# Altium schematic sheet Sheet1.SchDoc
size A3; Date: 2016.9.19; CheckedBy: CloudBoy; Author: CloudBoy; CompanyName: CloudStudio; Revision: V2.0; SheetNumber: 1; SheetTotal: 1; CurrentTime: 17:23; CurrentDate: 2016.9.19; DocumentName: CloudF4Block_Main
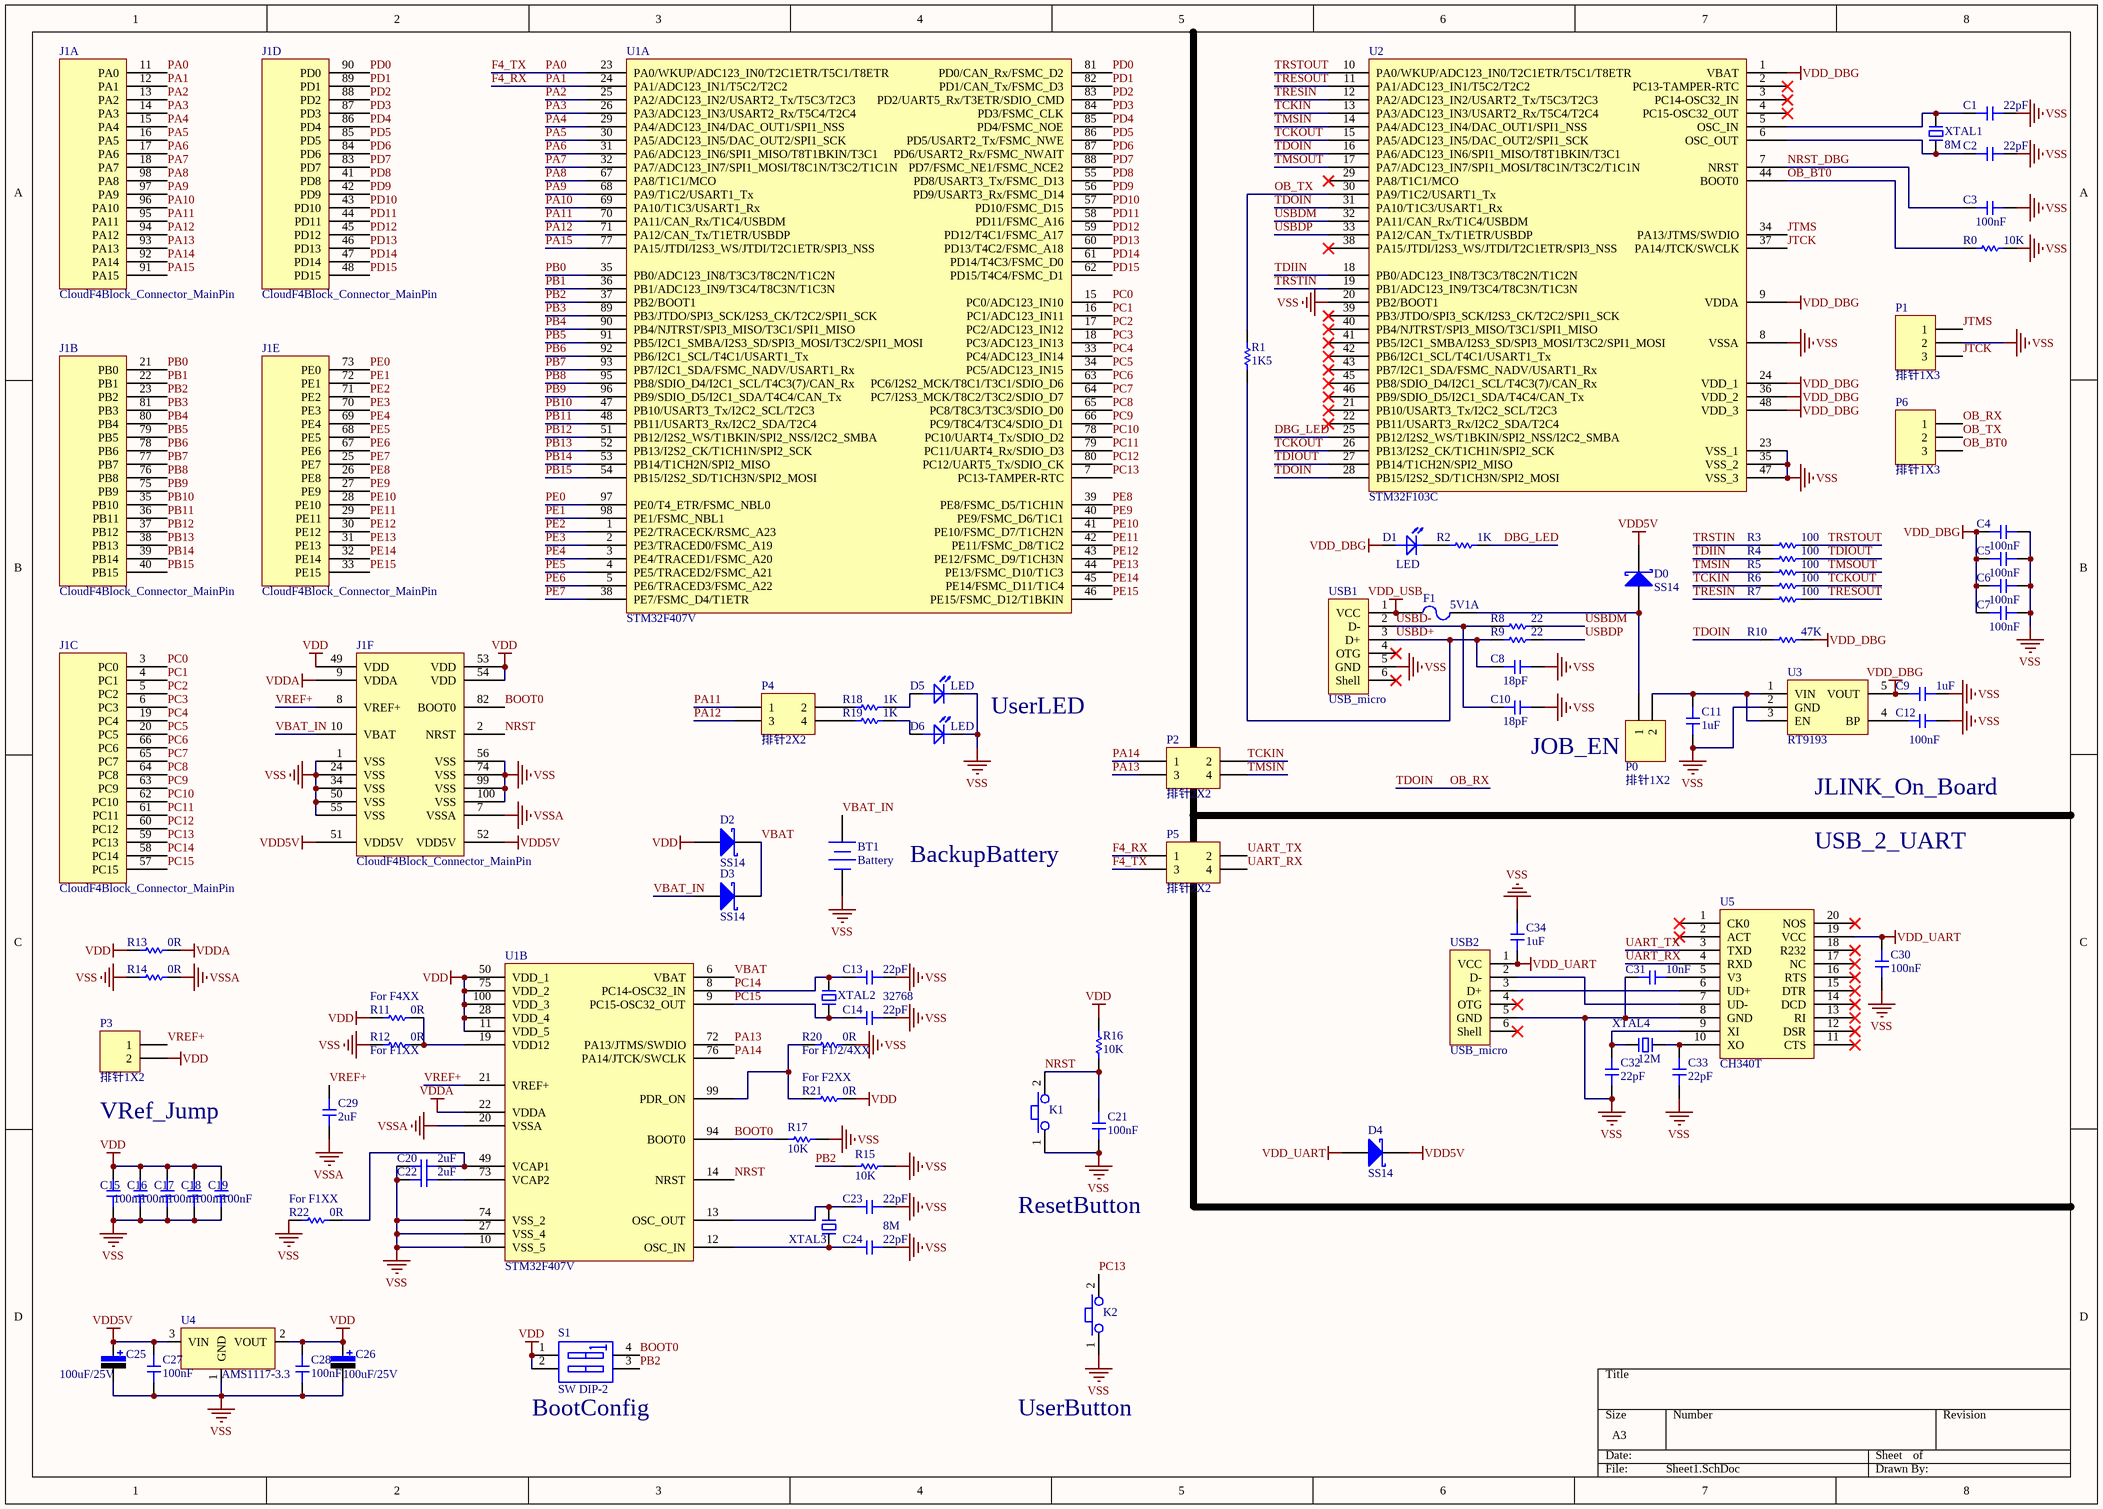
[diagram p0: Sheet1.SchDoc]

## Parts
BT1  Battery  [CR1220]
C1  value 22pF  [C-0603]  (hidden comment: Cap)
C2  value 22pF  [C-0603]  (hidden comment: Cap)
C3  value 100nF  [C-0603]  (hidden comment: Cap)
C4  value 100nF  [C-0603]  (hidden comment: Cap)
C5  value 100nF  [C-0603]  (hidden comment: Cap)
C6  value 100nF  [C-0603]  (hidden comment: Cap)
C7  value 100nF  [C-0603]  (hidden comment: Cap)
C8  value 18pF  [C-0603]  (hidden comment: Cap)
C9  value 1uF  [C-0805]  (hidden comment: Cap)
C10  value 18pF  [C-0603]  (hidden comment: Cap)
C11  value 1uF  [C-0805]  (hidden comment: Cap)
C12  value 100nF  [C-0603]  (hidden comment: Cap)
C13  value 22pF  [C-0603]  (hidden comment: Cap)
C14  value 22pF  [C-0603]  (hidden comment: Cap)
C15  value 100nF  [C-0603]  (hidden comment: Cap)
C16  value 100nF  [C-0603]  (hidden comment: Cap)
C17  value 100nF  [C-0603]  (hidden comment: Cap)
C18  value 100nF  [C-0603]  (hidden comment: Cap)
C19  value 100nF  [C-0603]  (hidden comment: Cap)
C20  value 2uF  [C-0603]  (hidden comment: Cap)
C21  value 100nF  [C-0603]  (hidden comment: Cap)
C22  value 2uF  [C-0603]  (hidden comment: Cap)
C23  value 22pF  [C-0603]  (hidden comment: Cap)
C24  value 22pF  [C-0603]  (hidden comment: Cap)
C25  value 100uF/25V  [C_TAN_C_6032]  (hidden comment: Cap-Pol-ES)
C26  value 100uF/25V  [C_TAN_C_6032]  (hidden comment: Cap-Pol-ES)
C27  value 100nF  [C-0603]  (hidden comment: Cap)
C28  value 100nF  [C-0603]  (hidden comment: Cap)
C29  value 2uF  [C-0603]  (hidden comment: Cap)
C30  value 100nF  [C-0603]  (hidden comment: Cap)
C31  value 10nF  [C-0603]  (hidden comment: Cap)
C32  value 22pF  [C-0603]  (hidden comment: Cap)
C33  value 22pF  [C-0603]  (hidden comment: Cap)
C34  value 1uF  [C-0603]  (hidden comment: Cap)
D0  SS14  [SOD123]
D1  LED  [0603LED_RED]
D2  SS14  [SOD123]
D3  SS14  [SOD123]
D4  SS14  [SOD123]
D5  LED  [0603LED_GREEN]
D6  LED  [0603LED_YELLOW]
F1  value 5V1A  [F-1812]  (hidden comment: 自恢复保险丝)
J1  CloudF4Block_Connector_MainPin  [CloudF4BlockConnector]  (parts A,B,C,D,E,F of 6)
K1  BUTTON_2PIN  [TS017]  (value not drawn)
K2  BUTTON_2PIN  [TS017]  (value not drawn)
P0  排针1X2  [IDC1x2-2.54]
P1  排针1X3  [IDC1x3-2.54]
P2  排针2X2  [IDC2x2-2.54]
P3  排针1X2  [IDC1x2-2.54]
P4  排针2X2  [IDC2x2-2.54]
P5  排针2X2  [IDC2x2-2.54]
P6  排针1X3  [IDC1x3-2.54]
R0  value 10K  [R-0603]  (hidden comment: RES)
R1  value 1K5  [R-0603]  (hidden comment: RES)
R2  value 1K  [R-0603]  (hidden comment: RES)
R3  value 100  [R-0603]  (hidden comment: RES)
R4  value 100  [R-0603]  (hidden comment: RES)
R5  value 100  [R-0603]  (hidden comment: RES)
R6  value 100  [R-0603]  (hidden comment: RES)
R7  value 100  [R-0603]  (hidden comment: RES)
R8  value 22  [R-0603]  (hidden comment: RES)
R9  value 22  [R-0603]  (hidden comment: RES)
R10  value 47K  [R-0603]  (hidden comment: RES)
R11  value 0R  [R-0603]  (hidden comment: RES)
R12  value 0R  [R-0603]  (hidden comment: RES)
R13  value 0R  [R-0603]  (hidden comment: RES)
R14  value 0R  [R-0603]  (hidden comment: RES)
R15  value 10K  [R-0603]  (hidden comment: RES)
R16  value 10K  [R-0603]  (hidden comment: RES)
R17  value 10K  [R-0603]  (hidden comment: RES)
R18  value 1K  [R-0603]  (hidden comment: RES)
R19  value 1K  [R-0603]  (hidden comment: RES)
R20  value 0R  [R-0603]  (hidden comment: RES)
R21  value 0R  [R-0603]  (hidden comment: RES)
R22  value 0R  [R-0603]  (hidden comment: RES)
S1  SW DIP-2  [KEY-DIP-2-SMD]
U1  STM32F407V  [TQFP100]  (parts A,B of 2)
U2  STM32F103C  [TQFP48]
U3  RT9193  [SOT23-5]
U4  AMS1117-3.3  [AMS1117]
U5  CH340T  [SSOP20]
USB1  USB_micro  [USB_Micro]
USB2  USB_micro  [USB_Micro]
XTAL1  value 8M  [XTAL-5032-2P]  (hidden comment: 无源晶振_2Pin)
XTAL2  value 32768  [XTAL_2X6 - SM]  (hidden comment: 无源晶振_2Pin)
XTAL3  value 8M  [XTAL-5032-2P]  (hidden comment: 无源晶振_2Pin)
XTAL4  value 12M  [XTAL-5032-2P]  (hidden comment: 无源晶振_2Pin)

## Nets
VDD: C15.2 C16.2 C17.2 C18.2 C19.2 C26.1 C28.2 D2.1(A) J1.49(VDD) J1.53(VDD) J1.54(VDD) P3.2 R11.2 R13.1 R16.1 R21.2 S1.1(A1) S1.2(A2) U1.11(VDD_5) U1.28(VDD_4) U1.50(VDD_1) U1.75(VDD_2) U1.100(VDD_3) U4.2(VOUT)
VDD5V: C25.1 C27.2 D0.2(K) D4.2(K) J1.51(VDD5V) J1.52(VDD5V) U4.3(VIN)
VDD_DBG: C4.1 C5.1 C6.1 C7.1 C9.1 D1.1(A) R10.2 U2.1(VBAT) U2.9(VDDA) U2.24(VDD_1) U2.36(VDD_2) U2.48(VDD_3) U3.5(VOUT)
VDD_UART: C30.1 C34.1 D4.1(A) U5.19(VCC) USB2.1(VCC)
VDD_USB: F1.1 USB1.1(VCC)
VDDA: J1.9(VDDA) R13.2 U1.22(VDDA)
VSS: BT1.2(-) C1.2 C2.2 C3.2 C4.2 C5.2 C6.2 C7.2 C8.2 C9.2 C10.2 C11.1 C12.2 C13.2 C14.2 C15.1 C16.1 C17.1 C18.1 C19.1 C20.1 C21.2 C22.1 C23.2 C24.2 C25.2 C26.2 C27.1 C28.1 C30.2 C31.1 C32.1 C33.1 C34.2 D5.2(K) D6.2(K) J1.1(VSS) J1.24(VSS) J1.34(VSS) J1.50(VSS) J1.55(VSS) J1.56(VSS) J1.74(VSS) J1.99(VSS) J1.100(VSS) K1.1 K2.1 P1.2 R0.2 R12.2 R14.1 R15.1 R17.1 R20.2 R22.2 U1.10(VSS_5) U1.27(VSS_4) U1.74(VSS_2) U2.8(VSSA) U2.20(PB2/BOOT1) U2.23(VSS_1) U2.35(VSS_2) U2.47(VSS_3) U3.2(GND) U4.1(GND) U5.8(GND) USB1.5(GND) USB2.5(GND)
VSSA: C29.1 J1.7(VSSA) R14.2 U1.20(VSSA)
BOOT0: J1.82(BOOT0) R17.2 S1.4(A4) U1.94(BOOT0)
DBG_LED: R2.2 U2.25(PB12/I2S2_WS/T1BKIN/SPI2_NSS/I2C2_SMBA)
F4_RX: J1.12(PA1) P5.1 U1.24(PA1/ADC123_IN1/T5C2/T2C2)  [also labelled PA1]
F4_TX: J1.11(PA0) P5.3 U1.23(PA0/WKUP/ADC123_IN0/T2C1ETR/T5C1/T8ETR)  [also labelled PA0]
JTCK: P1.3 U2.37(PA14/JTCK/SWCLK)
JTMS: P1.1 U2.34(PA13/JTMS/SWDIO)
NRST: C21.1 J1.2(NRST) K1.2 R16.2 U1.14(NRST)
NRST_DBG: C3.1 U2.7(NRST)
OB_BT0: P6.3 R0.1 U2.44(BOOT0)
OB_RX: P6.1 R10.1 U2.16(PA6/ADC123_IN6/SPI1_MISO/T8T1BKIN/T3C1) U2.28(PB15/I2S2_SD/T1CH3N/SPI2_MOSI) U2.31(PA10/T1C3/USART1_Rx)  [also labelled TDOIN]
OB_TX: P6.2 R1.2 U2.30(PA9/T1C2/USART1_Tx)
PA2: J1.13(PA2) U1.25(PA2/ADC123_IN2/USART2_Tx/T5C3/T2C3)
PA3: J1.14(PA3) U1.26(PA3/ADC123_IN3/USART2_Rx/T5C4/T2C4)
PA4: J1.15(PA4) U1.29(PA4/ADC123_IN4/DAC_OUT1/SPI1_NSS)
PA5: J1.16(PA5) U1.30(PA5/ADC123_IN5/DAC_OUT2/SPI1_SCK)
PA6: J1.17(PA6) U1.31(PA6/ADC123_IN6/SPI1_MISO/T8T1BKIN/T3C1)
PA7: J1.18(PA7) U1.32(PA7/ADC123_IN7/SPI1_MOSI/T8C1N/T3C2/T1C1N)
PA8: J1.98(PA8) U1.67(PA8/T1C1/MCO)
PA9: J1.97(PA9) U1.68(PA9/T1C2/USART1_Tx)
PA10: J1.96(PA10) U1.69(PA10/T1C3/USART1_Rx)
PA11: J1.95(PA11) P4.1 U1.70(PA11/CAN_Rx/T1C4/USBDM)
PA12: J1.94(PA12) P4.3 U1.71(PA12/CAN_Tx/T1ETR/USBDP)
PA13: J1.93(PA13) P2.3 U1.72(PA13/JTMS/SWDIO)
PA14: J1.92(PA14) P2.1 U1.76(PA14/JTCK/SWCLK)
PA15: J1.91(PA15) U1.77(PA15/JTDI/I2S3_WS/JTDI/T2C1ETR/SPI3_NSS)
PB0: J1.21(PB0) U1.35(PB0/ADC123_IN8/T3C3/T8C2N/T1C2N)
PB1: J1.22(PB1) U1.36(PB1/ADC123_IN9/T3C4/T8C3N/T1C3N)
PB2: J1.23(PB2) R15.2 S1.3(A3) U1.37(PB2/BOOT1)
PB3: J1.81(PB3) U1.89(PB3/JTDO/SPI3_SCK/I2S3_CK/T2C2/SPI1_SCK)
PB4: J1.80(PB4) U1.90(PB4/NJTRST/SPI3_MISO/T3C1/SPI1_MISO)
PB5: J1.79(PB5) U1.91(PB5/I2C1_SMBA/I2S3_SD/SPI3_MOSI/T3C2/SPI1_MOSI)
PB6: J1.78(PB6) U1.92(PB6/I2C1_SCL/T4C1/USART1_Tx)
PB7: J1.77(PB7) U1.93(PB7/I2C1_SDA/FSMC_NADV/USART1_Rx)
PB8: J1.76(PB8) U1.95(PB8/SDIO_D4/I2C1_SCL/T4C3(7)/CAN_Rx)
PB9: J1.75(PB9) U1.96(PB9/SDIO_D5/I2C1_SDA/T4C4/CAN_Tx)
PB10: J1.35(PB10) U1.47(PB10/USART3_Tx/I2C2_SCL/T2C3)
PB11: J1.36(PB11) U1.48(PB11/USART3_Rx/I2C2_SDA/T2C4)
PB12: J1.37(PB12) U1.51(PB12/I2S2_WS/T1BKIN/SPI2_NSS/I2C2_SMBA)
PB13: J1.38(PB13) U1.52(PB13/I2S2_CK/T1CH1N/SPI2_SCK)
PB14: J1.39(PB14) U1.53(PB14/T1CH2N/SPI2_MISO)
PB15: J1.40(PB15) U1.54(PB15/I2S2_SD/T1CH3N/SPI2_MOSI)
PC0: J1.3(PC0) U1.15(PC0/ADC123_IN10)
PC1: J1.4(PC1) U1.16(PC1/ADC123_IN11)
PC2: J1.5(PC2) U1.17(PC2/ADC123_IN12)
PC3: J1.6(PC3) U1.18(PC3/ADC123_IN13)
PC4: J1.19(PC4) U1.33(PC4/ADC123_IN14)
PC5: J1.20(PC5) U1.34(PC5/ADC123_IN15)
PC6: J1.66(PC6) U1.63(PC6/I2S2_MCK/T8C1/T3C1/SDIO_D6)
PC7: J1.65(PC7) U1.64(PC7/I2S3_MCK/T8C2/T3C2/SDIO_D7)
PC8: J1.64(PC8) U1.65(PC8/T8C3/T3C3/SDIO_D0)
PC9: J1.63(PC9) U1.66(PC9/T8C4/T3C4/SDIO_D1)
PC10: J1.62(PC10) U1.78(PC10/UART4_Tx/SDIO_D2)
PC11: J1.61(PC11) U1.79(PC11/UART4_Rx/SDIO_D3)
PC12: J1.60(PC12) U1.80(PC12/UART5_Tx/SDIO_CK)
PC13: J1.59(PC13) K2.2 U1.7(PC13-TAMPER-RTC)
PC14: C13.1 J1.58(PC14) U1.8(PC14-OSC32_IN) XTAL2.1
PC15: C14.1 J1.57(PC15) U1.9(PC15-OSC32_OUT) XTAL2.2
PD0: J1.90(PD0) U1.81(PD0/CAN_Rx/FSMC_D2)
PD1: J1.89(PD1) U1.82(PD1/CAN_Tx/FSMC_D3)
PD2: J1.88(PD2) U1.83(PD2/UART5_Rx/T3ETR/SDIO_CMD)
PD3: J1.87(PD3) U1.84(PD3/FSMC_CLK)
PD4: J1.86(PD4) U1.85(PD4/FSMC_NOE)
PD5: J1.85(PD5) U1.86(PD5/USART2_Tx/FSMC_NWE)
PD6: J1.84(PD6) U1.87(PD6/USART2_Rx/FSMC_NWAIT)
PD7: J1.83(PD7) U1.88(PD7/FSMC_NE1/FSMC_NCE2)
PD8: J1.41(PD8) U1.55(PD8/USART3_Tx/FSMC_D13)
PD9: J1.42(PD9) U1.56(PD9/USART3_Rx/FSMC_D14)
PD10: J1.43(PD10) U1.57(PD10/FSMC_D15)
PD11: J1.44(PD11) U1.58(PD11/FSMC_A16)
PD12: J1.45(PD12) U1.59(PD12/T4C1/FSMC_A17)
PD13: J1.46(PD13) U1.60(PD13/T4C2/FSMC_A18)
PD14: J1.47(PD14) U1.61(PD14/T4C3/FSMC_D0)
PD15: J1.48(PD15) U1.62(PD15/T4C4/FSMC_D1)
PE0: J1.73(PE0) U1.97(PE0/T4_ETR/FSMC_NBL0)
PE1: J1.72(PE1) U1.98(PE1/FSMC_NBL1)
PE2: J1.71(PE2) U1.1(PE2/TRACECK/RSMC_A23)
PE3: J1.70(PE3) U1.2(PE3/TRACED0/FSMC_A19)
PE4: J1.69(PE4) U1.3(PE4/TRACED1/FSMC_A20)
PE5: J1.68(PE5) U1.4(PE5/TRACED2/FSMC_A21)
PE6: J1.67(PE6) U1.5(PE6/TRACED3/FSMC_A22)
PE7: J1.25(PE7) U1.38(PE7/FSMC_D4/T1ETR)
PE8: J1.26(PE8) U1.39(PE8/FSMC_D5/T1CH1N)
PE9: J1.27(PE9) U1.40(PE9/FSMC_D6/T1C1)
PE10: J1.28(PE10) U1.41(PE10/FSMC_D7/T1CH2N)
PE11: J1.29(PE11) U1.42(PE11/FSMC_D8/T1C2)
PE12: J1.30(PE12) U1.43(PE12/FSMC_D9/T1CH3N)
PE13: J1.31(PE13) U1.44(PE13/FSMC_D10/T1C3)
PE14: J1.32(PE14) U1.45(PE14/FSMC_D11/T1C4)
PE15: J1.33(PE15) U1.46(PE15/FSMC_D12/T1BKIN)
TCKIN: P2.2 R6.1 U2.13(PA3/ADC123_IN3/USART2_Rx/T5C4/T2C4)
TCKOUT: R6.2 U2.15(PA5/ADC123_IN5/DAC_OUT2/SPI1_SCK) U2.26(PB13/I2S2_CK/T1CH1N/SPI2_SCK)
TDIIN: R4.1 U2.18(PB0/ADC123_IN8/T3C3/T8C2N/T1C2N)
TDIOUT: R4.2 U2.27(PB14/T1CH2N/SPI2_MISO)
TMSIN: P2.4 R5.1 U2.14(PA4/ADC123_IN4/DAC_OUT1/SPI1_NSS)
TMSOUT: R5.2 U2.17(PA7/ADC123_IN7/SPI1_MOSI/T8C1N/T3C2/T1C1N)
TRESIN: R7.1 U2.12(PA2/ADC123_IN2/USART2_Tx/T5C3/T2C3)
TRESOUT: R7.2 U2.11(PA1/ADC123_IN1/T5C2/T2C2)
TRSTIN: R3.1 U2.19(PB1/ADC123_IN9/T3C4/T8C3N/T1C3N)
TRSTOUT: R3.2 U2.10(PA0/WKUP/ADC123_IN0/T2C1ETR/T5C1/T8ETR)
UART_RX: P5.4 U5.4(RXD)
UART_TX: P5.2 U5.3(TXD)
USBD+: C8.1 R1.1 R9.1 USB1.3(D+)
USBD-: C10.1 R8.1 USB1.2(D-)
USBDM: R8.2 U2.32(PA11/CAN_Rx/T1C4/USBDM)
USBDP: R9.2 U2.33(PA12/CAN_Tx/T1ETR/USBDP)
VBAT: D2.2(K) D3.2(K) U1.6(VBAT)
VBAT_IN: BT1.1(+) D3.1(A) J1.10(VBAT)
VREF+: C29.2 J1.8(VREF+) P3.1 U1.21(VREF+)
NetC1_1: C1.1 U2.5(OSC_IN) XTAL1.1
NetC2_1: C2.1 U2.6(OSC_OUT) XTAL1.2
NetC11_2: C11.2 P0.2 U3.1(VIN) U3.3(EN)
NetC12_1: C12.1 U3.4(BP)
NetC20_2: C20.2 R22.1 U1.49(VCAP1)
NetC22_2: C22.2 U1.73(VCAP2)
NetC23_1: C23.1 U1.13(OSC_OUT) XTAL3.2
NetC24_1: C24.1 U1.12(OSC_IN) XTAL3.1
NetC31_2: C31.2 U5.5(V3)
NetC32_2: C32.2 U5.9(XI) XTAL4.2
NetC33_2: C33.2 U5.10(XO) XTAL4.1
NetD0_1: D0.1(A) F1.2 P0.1
NetD1_2: D1.2(K) R2.1
NetD5_1: D5.1(A) R18.2
NetD6_1: D6.1(A) R19.2
NetP4_2: P4.2 R18.1
NetP4_4: P4.4 R19.1
NetR11_1: R11.1 R12.1 U1.19(VDD12)
NetR20_1: R20.1 R21.1 U1.99(PDR_ON)
NetU5_6: U5.6(UD+) USB2.3(D+)
NetU5_7: U5.7(UD-) USB2.2(D-)

Not connected (* = marked no-connect by the designer): U2 2(PC13-TAMPER-RTC)* 3(PC14-OSC32_IN)* 4(PC15-OSC32_OUT)* 21(PB10/USART3_Tx/I2C2_SCL/T2C3)* 22(PB11/USART3_Rx/I2C2_SDA/T2C4)* 29(PA8/T1C1/MCO)* 38(PA15/JTDI/I2S3_WS/JTDI/T2C1ETR/SPI3_NSS)* 39(PB3/JTDO/SPI3_SCK/I2S3_CK/T2C2/SPI1_SCK)* 40(PB4/NJTRST/SPI3_MISO/T3C1/SPI1_MISO)* 41(PB5/I2C1_SMBA/I2S3_SD/SPI3_MOSI/T3C2/SPI1_MOSI)* 42(PB6/I2C1_SCL/T4C1/USART1_Tx)* 43(PB7/I2C1_SDA/FSMC_NADV/USART1_Rx)* 45(PB8/SDIO_D4/I2C1_SCL/T4C3(7)/CAN_Rx)* 46(PB9/SDIO_D5/I2C1_SDA/T4C4/CAN_Tx)*; U5 1(CK0)* 2(ACT)* 11(CTS)* 12(DSR)* 13(RI)* 14(DCD)* 15(DTR)* 16(RTS)* 17(NC)* 18(R232)* 20(NOS)*; USB1 4(OTG)* 6(Shell)*; USB2 4(OTG)* 6(Shell)*

## Notes on the sheet
- UserLED
- JOB_EN
- JLINK_On_Board
- USB_2_UART
- BackupBattery
- (near R12) For F1XX
- (near R11) For F4XX
- (near R20) For F1/2/4XX
- VRef_Jump
- (near R21) For F2XX
- (near R22) For F1XX
- ResetButton
- (near S1) BootConfig
- UserButton

## Library data of the parts
BT1 = Battery: CR1220纽扣电池座; Published: 24-Mar-1999; LatestRevisionDate: 17-Jul-2002; LatestRevisionNote: Re-released for DXP Platform.; PackageReference: BAT-2; Publisher: Altium Limited; PackageDescription: Battery; 2 Leads
C1-C8 C10 C12-C24 C27-C34 = Cap: 贴片电容0603
C9 C11 = Cap: 贴片电容0805
C25 C26 = Cap-Pol-ES: 钽电容C型; Published: 8-Jun-2000; LatestRevisionDate: 17-Jul-2002; LatestRevisionNote: Re-released for DXP Platform.; PackageReference: RB7.6-15; Publisher: Altium Limited
D0 D2-D4 = D Schottky: 1N5819肖特基SDO123; Published: 8-Jun-2000; LatestRevisionDate: 17-Jul-2002; LatestRevisionNote: Re-released for DXP Platform.; PackageReference: SMB; Publisher: Altium Limited; PackageDescription: DO-214-AA/SMB; 2 C-Bend Leads; Body 5.3 x 3.6 mm, inc. leads (LxW); Code_JEDEC: DO-214-AA
D1 D6 = LED: 红色LED 0603
D5 = LED: 绿色LED 0603
F1 = 自恢复保险丝: 1.5A自恢复保险丝 1812
J1 = CloudF4Block_Connector_MainPin: 25X2双排排母插座 2个
K1 K2 = BUTTON_2PIN: TS-017贴片侧边按键
R0-R22 = RES: 贴片电阻0603
S1 = SW DIP-2: 2X2编码开关; Published: 24-Mar-1999; LatestRevisionDate: 17-Jul-2002; LatestRevisionNote: Re-released for DXP Platform.; PackageReference: SO8; Publisher: Altium Limited; Code_JEDEC: MS-012-AA; Code_IPC: SO8
U1 = STM32F407V: STM32单片机100引脚
U2 = STM32F103C: STM32F103C8T6
U3 = RT9193: 3.3V LDO
U5 = CH340T: CH340T USB转串口
USB1 USB2 = USB_micro: MicroUSB贴片座
XTAL1 XTAL3 XTAL4 = 无源晶振_2Pin: 无源晶振5032
XTAL2 = 无源晶振_2Pin: 无源晶振32768圆柱